# Altium project PSLink.PrjPcb (part 2 of 3)

## Sheet Channel.SchDoc: CDR, Fanout, D-FF
size 420 x 297 mm; CheckedBy: E.Orzes F.Martina S.Baron; CompanyName: CERN; DrawnBy: E.Orzes; Organization: CERN; Address1: European Organization for Nuclear Research; Address2: CH-1211 Genève 23 - Switzerland; Revision: 1.0; SheetNumber: 5; SheetTotal: 6; Projet: Phase Stable Link; DivGrp: EP-ESE; Designer: E.Orzes; ModifiedDate: -
Used 4 times, as channels U_Channel_3, U_Channel_2, U_Channel_1, U_Channel_0. Parts and nets are listed once, with the designators drawn on the sheet.
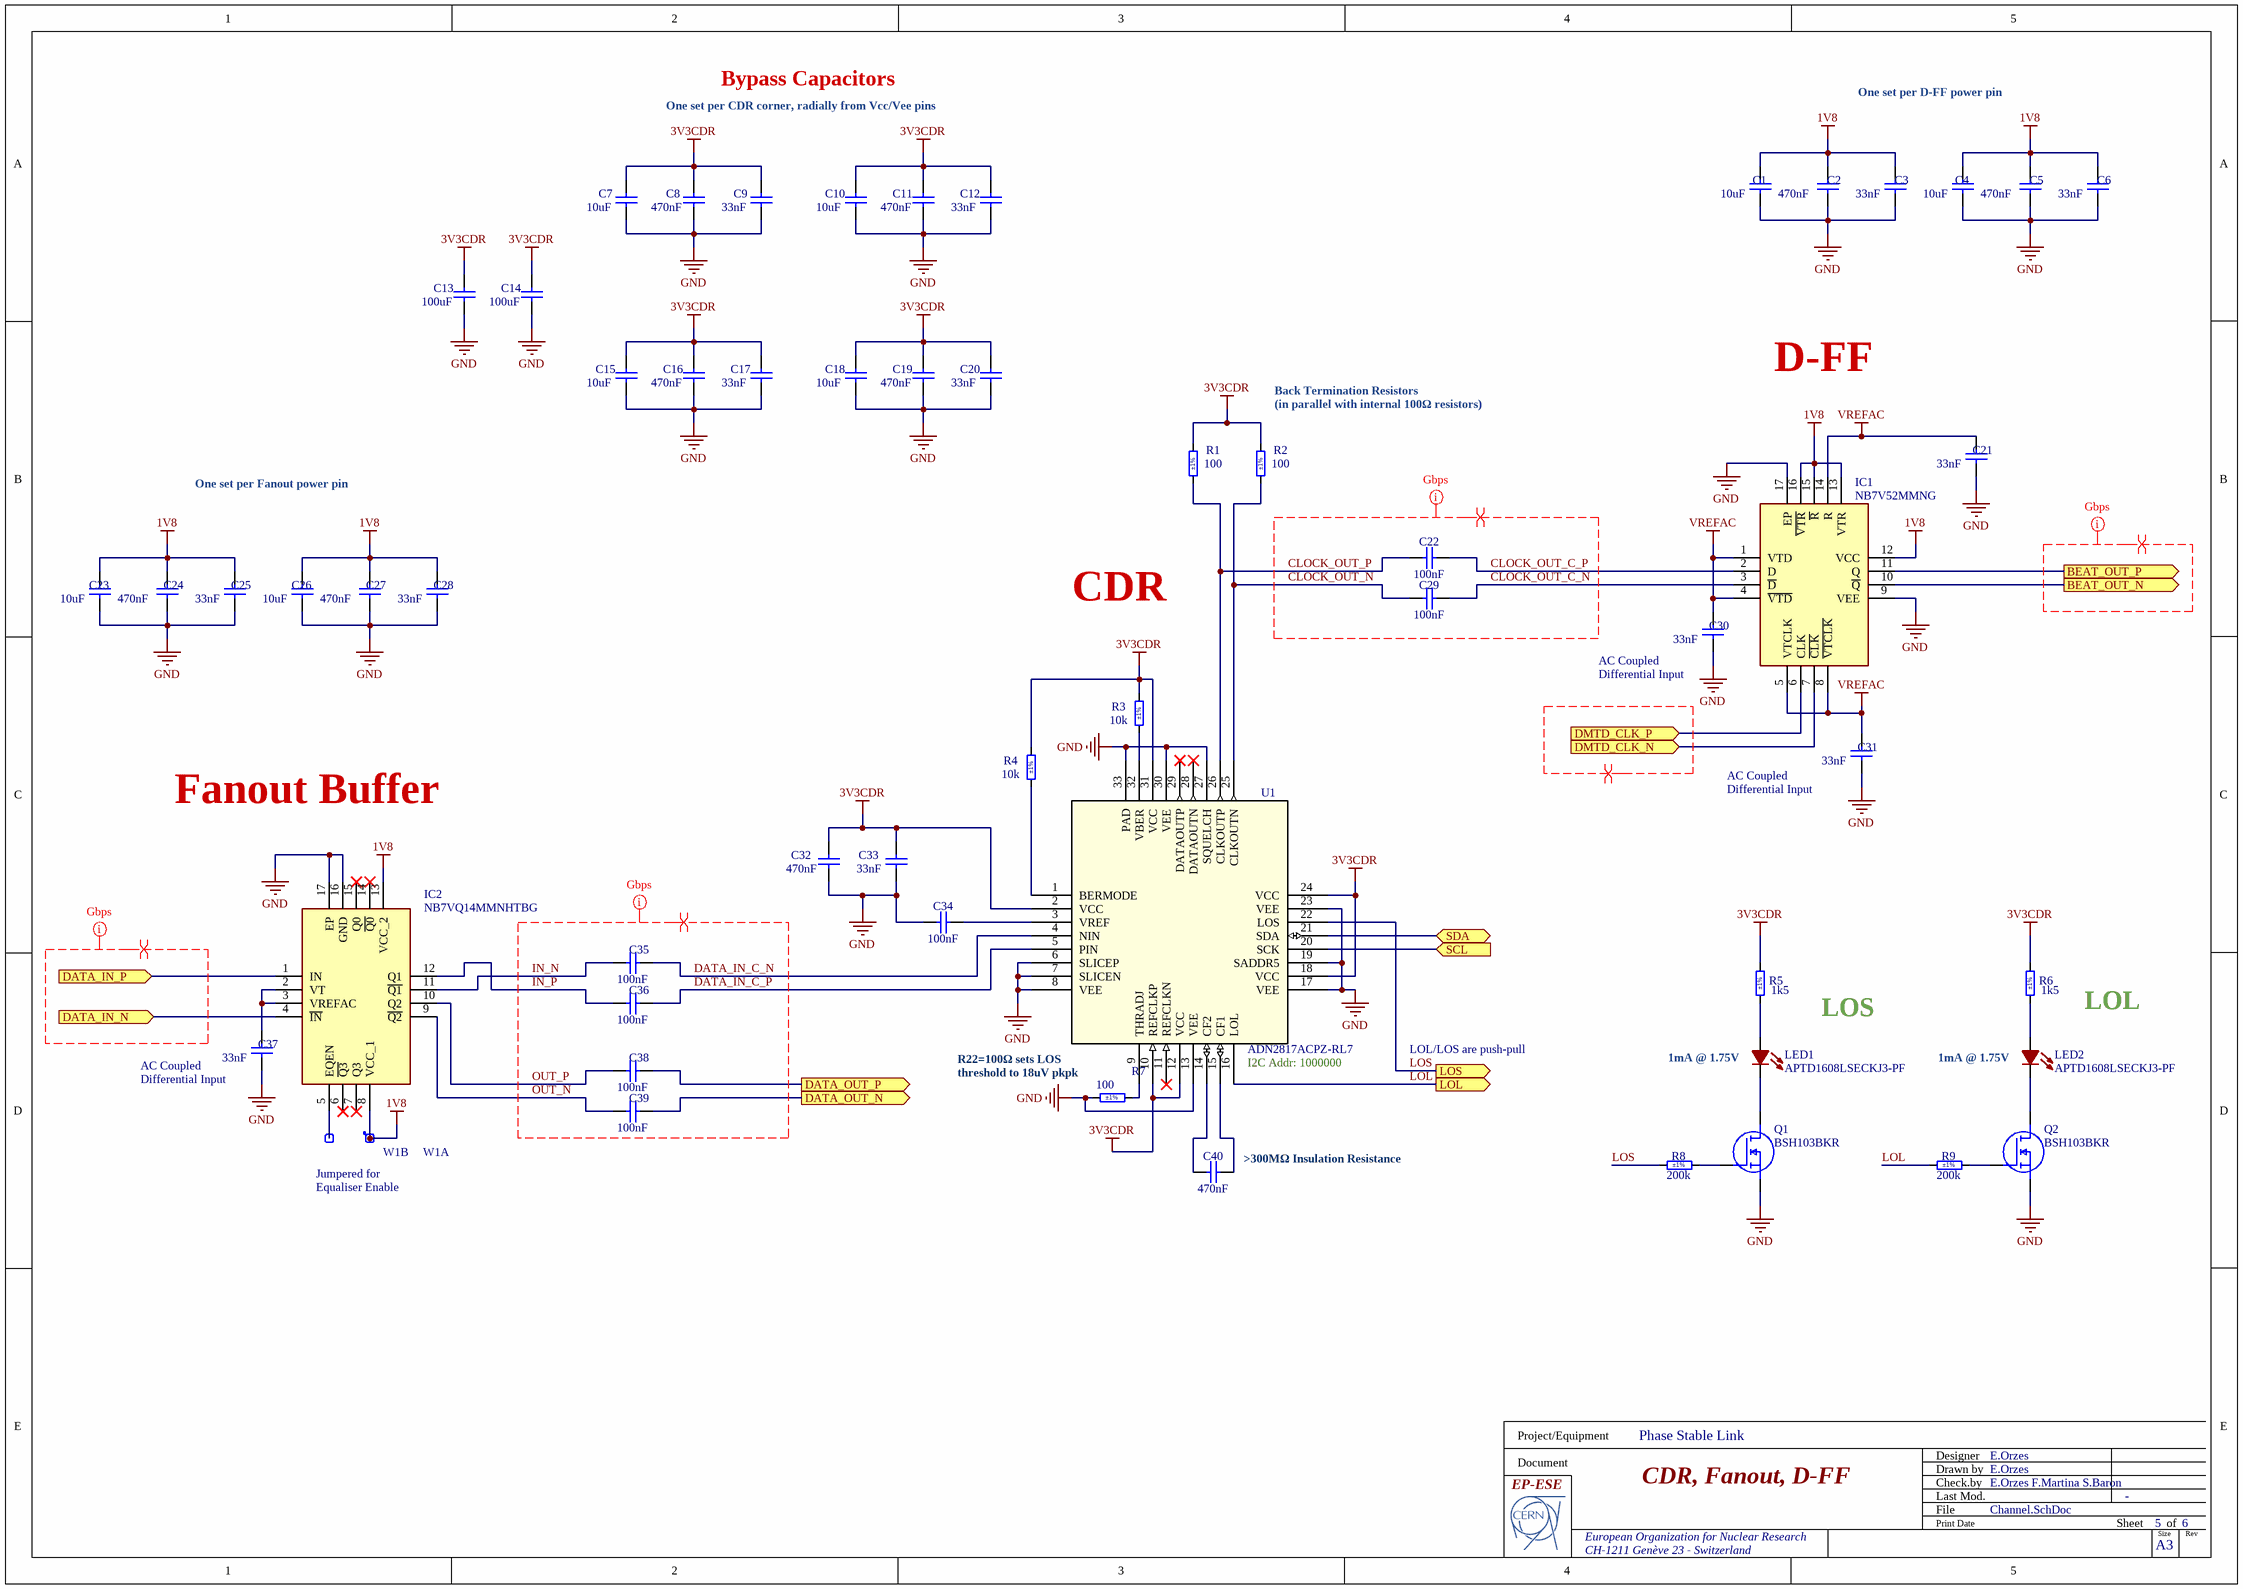
[diagram p3: Channel.SchDoc]

### Parts
C1  10uF  [CAPC1608X87N]
C2  470nF  [CAPC0510X04N]
C3  33nF  [LLL03TR61E333KE01]
C4  10uF  [CAPC1608X87N]
C5  470nF  [CAPC0510X04N]
C6  33nF  [LLL03TR61E333KE01]
C7  10uF  [CAPC1608X87N]
C8  470nF  [CAPC0510X04N]
C9  33nF  [LLL03TR61E333KE01]
C10  10uF  [CAPC1608X87N]
C11  470nF  [CAPC0510X04N]
C12  33nF  [LLL03TR61E333KE01]
C13  100uF  [CAPC3225X270N]
C14  100uF  [CAPC3225X270N]
C15  10uF  [CAPC1608X87N]
C16  470nF  [CAPC0510X04N]
C17  33nF  [LLL03TR61E333KE01]
C18  10uF  [CAPC1608X87N]
C19  470nF  [CAPC0510X04N]
C20  33nF  [LLL03TR61E333KE01]
C21  33nF  [LLL03TR61E333KE01]
C22  100nF  [CAPC0603X33N]
C23  10uF  [CAPC1608X87N]
C24  470nF  [CAPC0510X04N]
C25  33nF  [LLL03TR61E333KE01]
C26  10uF  [CAPC1608X87N]
C27  470nF  [CAPC0510X04N]
C28  33nF  [LLL03TR61E333KE01]
C29  100nF  [CAPC0603X33N]
C30  33nF  [LLL03TR61E333KE01]
C31  33nF  [LLL03TR61E333KE01]
C32  470nF  [CAPC0510X04N]
C33  33nF  [LLL03TR61E333KE01]
C34  100nF  [CAPC0603X33N]
C35  100nF  [CAPC0603X33N]
C36  100nF  [CAPC0603X33N]
C37  33nF  [LLL03TR61E333KE01]
C38  100nF  [CAPC0603X33N]
C39  100nF  [CAPC0603X33N]
C40  470nF  [CAPC2013X140N]
IC1  NB7V52MMNG  [QFN50P300X300X100-17N]
IC2  NB7VQ14MMNHTBG  [QFN50P300X300X100-17N]
LED1  APTD1608LSECKJ3-PF  [LED_APTD1608LSECKJ3-PF_KNB]
LED2  APTD1608LSECKJ3-PF  [LED_APTD1608LSECKJ3-PF_KNB]
Q1  BSH103BKR  [SOT95P230X110-3N]
Q2  BSH103BKR  [SOT95P230X110-3N]
R1  100  Tolerance: ±1%  [RESC0603X28N]
R2  100  Tolerance: ±1%  [RESC0603X28N]
R3  10k  Tolerance: ±1%  [RESC1005X40N]
R4  10k  Tolerance: ±1%  [RESC1005X40N]
R5  1k5  Tolerance: ±1%  [RESC1005X40N]
R6  1k5  Tolerance: ±1%  [RESC1005X40N]
R7  100  Tolerance: ±1%  [RESC0603X28N]
R8  200k  Tolerance: ±1%  [RESC1005X40N]
R9  200k  Tolerance: ±1%  [RESC1005X40N]
U1  ADN2817ACPZ-RL7  [CP_32_11_ADI]
W1  Header 2  [SAMTEC_HTSW-102-23-L-S]  (value not drawn)  (parts A,B of 2)

### Ports
BEAT_OUT_N (out), BEAT_OUT_P (out), DATA_IN_N (in), DATA_IN_P (in), DATA_OUT_N (out), DATA_OUT_P (out), DMTD_CLK_N (in), DMTD_CLK_P (in), LOL (out), LOS (out), SCL (in), SDA (bidir)

### Nets
1V8: C1.2 C2.2 C3.2 C4.2 C5.2 C6.2 C23.2 C24.2 C25.2 C26.2 C27.2 C28.2 IC1.12(VCC) IC1.13(VTR) IC1.15(~{R}) IC1.16(~{VTR}) IC2.8(VCC_1) IC2.13(VCC_2) W1.1
3V3CDR: C7.2 C8.2 C9.2 C10.2 C11.2 C12.2 C13.2 C14.2 C15.2 C16.2 C17.2 C18.2 C19.2 C20.2 C32.2 C33.2 R1.2 R2.2 R3.2 R4.2 R5.2 R6.2 U1.2(VCC) U1.10(REFCLKP) U1.12(VCC) U1.18(VCC) U1.24(VCC) U1.31(VCC)
GND: C1.1 C2.1 C3.1 C4.1 C5.1 C6.1 C7.1 C8.1 C9.1 C10.1 C11.1 C12.1 C13.1 C14.1 C15.1 C16.1 C17.1 C18.1 C19.1 C20.1 C21.1 C23.1 C24.1 C25.1 C26.1 C27.1 C28.1 C30.1 C31.1 C32.1 C33.1 C34.1 C37.1 IC1.9(VEE) IC1.17(EP) IC2.16(GND) IC2.17(EP) Q1.2(S) Q2.2(S) R7.1 U1.6(SLICEP) U1.7(SLICEN) U1.8(VEE) U1.13(VEE) U1.17(VEE) U1.19(SADDR5) U1.23(VEE) U1.27(SQUELCH) U1.30(VEE) U1.33(PAD)
VREFAC: C21.2 C30.2 C31.2 IC1.1(VTD) IC1.4(~{VTD}) IC1.5(VTCLK) IC1.8(~{VTCLK}) IC1.14(R)
BEAT_OUT_N: IC1.10(~{Q}) ; port BEAT_OUT_N
BEAT_OUT_P: IC1.11(Q) ; port BEAT_OUT_P
CLOCK_OUT_C_N: C29.2 IC1.3(~{D})
CLOCK_OUT_C_P: C22.2 IC1.2(D)
CLOCK_OUT_N: C29.1 R2.1 U1.25(CLKOUTN)
CLOCK_OUT_P: C22.1 R1.1 U1.26(CLKOUTP)
DATA_IN_C_N: C35.2 U1.4(NIN)
DATA_IN_C_P: C36.2 U1.5(PIN)
DATA_IN_N: IC2.4(~{IN}) ; port DATA_IN_N
DATA_IN_P: IC2.1(IN) ; port DATA_IN_P
DATA_OUT_N: C39.2 ; port DATA_OUT_N
DATA_OUT_P: C38.2 ; port DATA_OUT_P
DMTD_CLK_N: IC1.7(~{CLK}) ; port DMTD_CLK_N
DMTD_CLK_P: IC1.6(CLK) ; port DMTD_CLK_P
IN_N: C35.1 IC2.11(~{Q1})
IN_P: C36.1 IC2.12(Q1)
LOL: R9.1 U1.16(LOL) ; port LOL
LOS: R8.1 U1.22(LOS) ; port LOS
OUT_N: C39.1 IC2.9(~{Q2})
OUT_P: C38.1 IC2.10(Q2)
SCL: U1.20(SCK) ; port SCL
SDA: U1.21(SDA) ; port SDA
NetC34_2: C34.2 U1.3(VREF)
NetC37_2: C37.2 IC2.2(VT) IC2.3(VREFAC)
NetC40_1: C40.1 U1.14(CF2)
NetC40_2: C40.2 U1.15(CF1)
NetIC2_5: IC2.5(EQEN) W1.2
NetLED1_1: LED1.1(C) Q1.3(D)
NetLED1_2: LED1.2(A) R5.1
NetLED2_1: LED2.1(C) Q2.3(D)
NetLED2_2: LED2.2(A) R6.1
NetQ1_1: Q1.1(G) R8.2
NetQ2_1: Q2.1(G) R9.2
NetR3_1: R3.1 U1.32(VBER)
NetR4_1: R4.1 U1.1(BERMODE)
NetR7_2: R7.2 U1.9(THRADJ)

Not connected (* = marked no-connect by the designer): IC2 6(~{Q3})* 7(Q3)* 14(~{Q0})* 15(Q0)*; U1 11(REFCLKN)* 28(DATAOUTN)* 29(DATAOUTP)*

### Channels
U_Channel_3: designators end in _U_Channel_3; ports BEAT_OUT_N=BEAT_3_N BEAT_OUT_P=BEAT_3_P DATA_IN_N=FPGA_TX0_N DATA_IN_P=FPGA_TX0_P DATA_OUT_N=SFP_TX0_N DATA_OUT_P=SFP_TX0_P DMTD_CLK_N=DMTD_CLK_3_N DMTD_CLK_P=DMTD_CLK_3_P LOL=LOL LOS=LOL_3 SCL=SCL_2 SDA=SDA_2
U_Channel_2: designators end in _U_Channel_2; ports BEAT_OUT_N=BEAT_2_N BEAT_OUT_P=BEAT_2_P DATA_IN_N=SFP_RX1_N DATA_IN_P=SFP_RX1_P DATA_OUT_N=FPGA_RX1_N DATA_OUT_P=FPGA_RX1_P DMTD_CLK_N=DMTD_CLK_2_N DMTD_CLK_P=DMTD_CLK_2_P LOL=LOL LOS=LOL_2 SCL=SCL_3 SDA=SDA_3
U_Channel_1: designators end in _U_Channel_1; ports BEAT_OUT_N=BEAT_1_N BEAT_OUT_P=BEAT_1_P DATA_IN_N=FPGA_TX1_N DATA_IN_P=FPGA_TX1_P DATA_OUT_N=SFP_TX1_N DATA_OUT_P=SFP_TX1_P DMTD_CLK_N=DMTD_CLK_1_N DMTD_CLK_P=DMTD_CLK_1_P LOL=LOL LOS=LOL_1 SCL=SCL_4 SDA=SDA_4
U_Channel_0: designators end in _U_Channel_0; ports BEAT_OUT_N=BEAT_0_N BEAT_OUT_P=BEAT_0_P DATA_IN_N=SFP_RX0_N DATA_IN_P=SFP_RX0_P DATA_OUT_N=FPGA_RX0_N DATA_OUT_P=FPGA_RX0_P DMTD_CLK_N=DMTD_CLK_0_N DMTD_CLK_P=DMTD_CLK_0_P LOL=LOL LOS=LOL_0 SCL=SCL_5 SDA=SDA_5

### Layout directives
differential pair: (no net found under the mark), CLOCK_OUT_C_N, CLOCK_OUT_C_P, CLOCK_OUT_N, CLOCK_OUT_P, DATA_IN_C_N, DATA_IN_C_P, IN_N, IN_P, OUT_N, OUT_P
mark named Gbps: (no net found under the mark), CLOCK_OUT_C_N, CLOCK_OUT_C_P, CLOCK_OUT_N, CLOCK_OUT_P, DATA_IN_C_N, DATA_IN_C_P, IN_N, IN_P, OUT_N, OUT_P

### Notes on the sheet
- Bypass Capacitors
- One set per CDR corner, radially from Vcc/Vee pins
- One set per D-FF power pin
- D-FF
- (near R2) Back Termination Resistors
  (in parallel with internal 100Ω resistors)
- One set per Fanout power pin
- CDR
- (near C30) AC Coupled
  Differential Input
- (near C31) AC Coupled
  Differential Input
- Fanout Buffer
- (near U1) R22=100Ω sets LOS threshold to 18uV pkpk
- (near U1) I2C Addr: 1000000
- LOL/LOS are push-pull
- (near LED1) 1mA @ 1.75V
- LOS
- (near LED2) 1mA @ 1.75V
- LOL
- (near C37) AC Coupled
  Differential Input
- (near W1) Jumpered for Equaliser Enable
- (near C40) >300MΩ Insulation Resistance
- Project/Equipment
- Document
- Designer
- Drawn by
- Check.by
- File
- Last Mod.
- Print Date
- Sheet
- Size
- A3
- of
- Rev

### Library data of the parts
C1 C4 C7 C10 C15 C18 C23 C26 = CC0603_10UF_6.3V_20%_X5R: GRM188D71A106KA73; Part Description: SMD Multilayer Chip Ceramic Capacitor; Manufacturer: GENERIC; Manufacturer1 Part Number: C0603C106M9PAC; Voltage: 6.3V; TC: X5R; Tolerance: ±20%; Part Number: CC0603_10UF_6.3V_20%_X5R; Component Kind: Standard; Component Type: Standard; Pin Count: 2; Value: 10uF; Status: Preferred; Manufacturer Part Number: CC0603_10uF_6.3V_20%_X5R; Case: 0603; Mounted: Yes; Socket: No; SMD: Yes; Sense: No; Manufacturer1 Example: KEMET; Manufacturer1 ComponentHeight: 0.95mm; HelpURL: \\cern.ch\dfs\Applications\Altium\Datasheets\CC0603_X5R_KEMET.pdf; Author: CERN DEM JLC; CreateDate: 03/12/2007; LatestRevisionDate: 03/12/2007
C2 C5 C8 C11 C16 C19 C24 C27 C32 = Capacitor - non polarized: LLL153C70G474ME17; Value: 470nF
C3 C6 C9 C12 C17 C20 C21 C25 C28 C30 C31 C33 C37 = Capacitor - non polarized: LLL03TR61E333KE01; Value: 33nF
C13 C14 = CC1210_100UF_6.3V_20%_X7U: GRM32EC70J107ME15; Part Description: SMD Multilayer Chip Ceramic Capacitor; Manufacturer: GENERIC; Manufacturer1 Part Number: GRM32EE70J107ME15L; Voltage: 6.3V; TC: X7U; Tolerance: ±20%; Part Number: CC1210_100UF_6.3V_20%_X7U; Component Kind: Standard; Component Type: Standard; Pin Count: 2; Value: 100uF; Status: None; Manufacturer Part Number: CC1210_100UF_6.3V_20%_X7U; Case: 1210; Mounted: Yes; Socket: No; SMD: Yes; Sense: No; Manufacturer1 Example: MURATA; Manufacturer1 ComponentHeight: 2.7mm; HelpURL: \\cern.ch\dfs\Applications\Altium\Datasheets\CC1210_X7U_MURATA.pdf; Author: CERN DEM MR; CreateDate: 10/12/2017; LatestRevisionDate: 10/12/2017
C22 C29 C34-C36 C38 C39 = CC0201_100NF_6.3V_10%_X7R: Non-polarised capacitor; Part Description: SMD Multilayer Chip Ceramic Capacitor; Manufacturer: GENERIC; Manufacturer1 Part Number: CC0201KRX7R5BB104; Voltage: 6.3V; TC: X7R; Tolerance: ±10%; Part Number: CC0201_100NF_6.3V_10%_X7R; Component Kind: Standard; Component Type: Standard; Pin Count: 2; Value: 100nF; Status: Not Recommended; Manufacturer Part Number: CC0201_100NF_6.3V_10%_X7R; Case: 0201; Mounted: Yes; Socket: No; SMD: Yes; Sense: No; Manufacturer1 Example: YAGEO PHYCOMP; Manufacturer1 ComponentHeight: 0.33mm; HelpURL: \\cern.ch\dfs\Applications\Altium\Datasheets\CC0201_X7R_YAGEO_6.3VTO50V.pdf; Author: CERN DEM BC; CreateDate: 11/20/2020; LatestRevisionDate: 11/20/2020
C40 = CC0805_470NF_50V_10%_X7R_MURATA_GCM21BR71H474KA55L: GCM21BR71H474KA55L; Part Description: SMD Chip Monolithic Ceramic Capacitor for Automotive; Manufacturer: MURATA; Voltage: 50V; TC: X7R; Tolerance: ±10%; Part Number: CC0805_470NF_50V_10%_X7R_MURATA_GCM21BR71H474KA55L; Component Kind: Standard; Component Type: Standard; Pin Count: 2; Value: 470nF; Status: Not Recommended; Manufacturer Part Number: GCM21BR71H474KA55L; Case: 0805; Mounted: Yes; Socket: No; SMD: Yes; Sense: No; ComponentHeight: 1.4mm; HelpURL: \\cern.ch\dfs\Applications\Altium\Datasheets\CC0805_MURATA_GCM21BR71H474KA55L.pdf; Author: CERN DEM JLC; CreateDate: 5/10/2017; LatestRevisionDate: 5/10/2017
IC1 = NB7V52MMNG: Integrated Circuit; Manufacturer_Name: onsemi; Datasheet Link: https://www.onsemi.com/pdf/datasheet/nb7v52m-d.pdf; Height: 1mm; Manufacturer_Part_Number: NB7V52MMNG; Mouser Part Number: 863-NB7V52MMNG; Mouser Price/Stock: https://www.mouser.co.uk/ProductDetail/ON-Semiconductor/NB7V52MMNG?qs=N5dOQkml4H8i91m%252BmwlaUQ%3D%3D; Arrow Part Number: NB7V52MMNG; Arrow Price/Stock: https://www.arrow.com/en/products/nb7v52mmng/on-semiconductor
IC2 = NB7VQ14MMNHTBG: Integrated Circuit; Manufacturer_Name: onsemi; Datasheet Link: http://www.onsemi.com/pub/Collateral/NB7VQ14M-D.PDF; Height: 1mm; Manufacturer_Part_Number: NB7VQ14MMNHTBG; Mouser Part Number: 863-NB7VQ14MMNHTBG; Mouser Price/Stock: https://www.mouser.co.uk/ProductDetail/onsemi/NB7VQ14MMNHTBG?qs=3PKVEWFFm2%2FWq%2FFZ4xstfg%3D%3D; Arrow Part Number: NB7VQ14MMNHTBG; Arrow Price/Stock: https://www.arrow.com/en/products/nb7vq14mmnhtbg/on-semiconductor?utm_currency=USD&region=nac
LED1 LED2 = APTD1608LSECKJ3-PF: Led Red 0603 2mA 1.8V 50mcd 84mW; Mfr_Name: Kingbright
Q1 Q2 = BSH103BKR: MOSFET (N-Channel); Manufacturer_Name: Nexperia; Datasheet Link: https://ms.componentsearchengine.com/Datasheets/2/BSH103BKR.pdf; Height: 1.1mm; Manufacturer_Part_Number: BSH103BKR; Mouser Part Number: 771-BSH103BKR; Mouser Price/Stock: https://www.mouser.co.uk/ProductDetail/Nexperia/BSH103BKR?qs=GCAb4wyKXLKD%2FWt2ta8c7Q%3D%3D; Arrow Part Number: BSH103BKR; Arrow Price/Stock: https://www.arrow.com/en/products/bsh103bkr/nexperia?region=europe
R1 R2 R7 = R0201_100R_1%_0.05W_200PPM: Resistor - 1%; Part Description: Thick Film Chip Resistor; Manufacturer: GENERIC; Manufacturer1 Part Number: CRCW0201100RFNED; Power: 0.05W; TC: ±200ppm/°C; PressFit: No; Part Number: R0201_100R_1%_0.05W_200PPM; Component Kind: Standard; Component Type: Standard; Pin Count: 2; Value: 100; Status: Not Recommended; Manufacturer Part Number: R0201_100R_1%_0.05W_200PPM; Case: 0201; Mounted: Yes; Sense: No; Socket: No; SMD: Yes; Manufacturer1 Example: VISHAY; Manufacturer1 ComponentHeight: 0.27mm; HelpURL: \\cern.ch\dfs\Applications\Altium\Datasheets\R0201_VISHAY_CRCW e3.pdf; Author: CERN DEM JLC; CreateDate: 11/13/2014; LatestRevisionDate: 11/13/2014
R3 = R0402_10K_1%_0.0625W_100PPM: Resistor - 1%; Part Description: General Purpose Thick Film Chip Resistor; Manufacturer: GENERIC; Manufacturer1 Part Number: 232270671003L; TC: ±100ppm/°C; PressFit: No; Mounted: No; Part Number: R0402_10K_1%_0.0625W_100PPM; Component Kind: Standard; Component Type: Standard; Pin Count: 2; Value: 10k; Status: Not Recommended; Power: 0.0625W; Manufacturer Part Number: R0402_10K_1%_0.0625W_100PPM; Case: 0402; Sense: No; Socket: No; SMD: Yes; Manufacturer1 Example: YAGEO PHYCOMP; Manufacturer1 ComponentHeight: 0.4mm; HelpURL: \\cern.ch\dfs\Applications\Altium\Datasheets\R0402_Phycomp_RC0402.pdf; Author: CERN DEM JLC; CreateDate: 12/3/2007; LatestRevisionDate: 10/17/2012
R4 = R0402_10K_1%_0.0625W_100PPM: Resistor - 1%; Part Description: General Purpose Thick Film Chip Resistor; Manufacturer: GENERIC; Manufacturer1 Part Number: 232270671003L; TC: ±100ppm/°C; PressFit: No; Part Number: R0402_10K_1%_0.0625W_100PPM; Component Kind: Standard; Component Type: Standard; Pin Count: 2; Value: 10k; Status: Not Recommended; Power: 0.0625W; Manufacturer Part Number: R0402_10K_1%_0.0625W_100PPM; Case: 0402; Mounted: Yes; Sense: No; Socket: No; SMD: Yes; Manufacturer1 Example: YAGEO PHYCOMP; Manufacturer1 ComponentHeight: 0.4mm; HelpURL: \\cern.ch\dfs\Applications\Altium\Datasheets\R0402_Phycomp_RC0402.pdf; Author: CERN DEM JLC; CreateDate: 12/3/2007; LatestRevisionDate: 10/17/2012
R5 R6 = R0402_1K5_1%_0.0625W_100PPM: Resistor - 1%; Part Description: General Purpose Thick Film Chip Resistor; Manufacturer: GENERIC; Manufacturer1 Part Number: 232270671502L; TC: ±100ppm/°C; PressFit: No; Part Number: R0402_1K5_1%_0.0625W_100PPM; Component Kind: Standard; Component Type: Standard; Pin Count: 2; Value: 1k5; Status: Not Recommended; Power: 0.0625W; Manufacturer Part Number: R0402_1K5_1%_0.0625W_100PPM; Case: 0402; Mounted: Yes; Sense: No; Socket: No; SMD: Yes; Manufacturer1 Example: YAGEO PHYCOMP; Manufacturer1 ComponentHeight: 0.4mm; HelpURL: \\cern.ch\dfs\Applications\Altium\Datasheets\R0402_Phycomp_RC0402.pdf; Author: CERN DEM JLC; CreateDate: 12/3/2007; LatestRevisionDate: 10/17/2012
R8 R9 = R0402_200K_1%_0.0625W_100PPM: Resistor - 1%; Part Description: General Purpose Thick Film Chip Resistor; Manufacturer: GENERIC; Manufacturer1 Part Number: 232270672004L; TC: ±100ppm/°C; PressFit: No; Part Number: R0402_200K_1%_0.0625W_100PPM; Component Kind: Standard; Component Type: Standard; Pin Count: 2; Value: 200k; Status: Not Recommended; Power: 0.0625W; Manufacturer Part Number: R0402_200K_1%_0.0625W_100PPM; Case: 0402; Mounted: Yes; Sense: No; Socket: No; SMD: Yes; Manufacturer1 Example: YAGEO PHYCOMP; Manufacturer1 ComponentHeight: 0.4mm; HelpURL: \\cern.ch\dfs\Applications\Altium\Datasheets\R0402_Phycomp_RC0402.pdf; Author: CERN DEM JLC; CreateDate: 12/3/2007; LatestRevisionDate: 10/17/2012
U1 = ADN2817ACPZ-RL7: No Description Available; Mfr_Name: Analog Devices Inc; RefDes: RefDes; Type: Type
W1 = SAMTEC_HTSW-102-23-L-S: 2 Mini Wire-Wrap Contact Strip Header; Part Description: 2 Contacts, Pitch 2.54mm, Single Row  Through Mount Straight Header (Post Lead 5.84mm, Tail Lead 2.92mm, Insulator 2.54mm); Manufacturer: SAMTEC; PressFit: No; Status Comment: High Temperature; Part Number: SAMTEC_HTSW-102-23-L-S; Component Kind: Standard; Component Type: Standard; Pin Count: 2; Family: Header 2; Mounted: Yes; Socket: No; SMD: No; Sense: No; Status: Preferred; Manufacturer Part Number: HTSW-102-23-L-S; ComponentHeight: 8.38mm; HelpURL: \\cern.ch\dfs\Applications\Altium\Datasheets\SAMTEC_HTSW-102-23-L-S.pdf; Author: CERN DEM JLC; CreateDate: 2/22/2018; LatestRevisionDate: 2/22/2018

## Sheet power-sheet.SchDoc: Power Regulator
size 420 x 297 mm; CheckedBy: E.Orzes F.Martina S.Baron; CompanyName: CERN; DrawnBy: E.Orzes; Organization: CERN; Address1: European Organization for Nuclear Research; Address2: CH-1211 Genève 23 - Switzerland; Revision: 1.0; SheetNumber: 6; SheetTotal: 6; Projet: Phase Stable Link; DivGrp: EP-ESE; Designer: E.Orzes; ModifiedDate: -
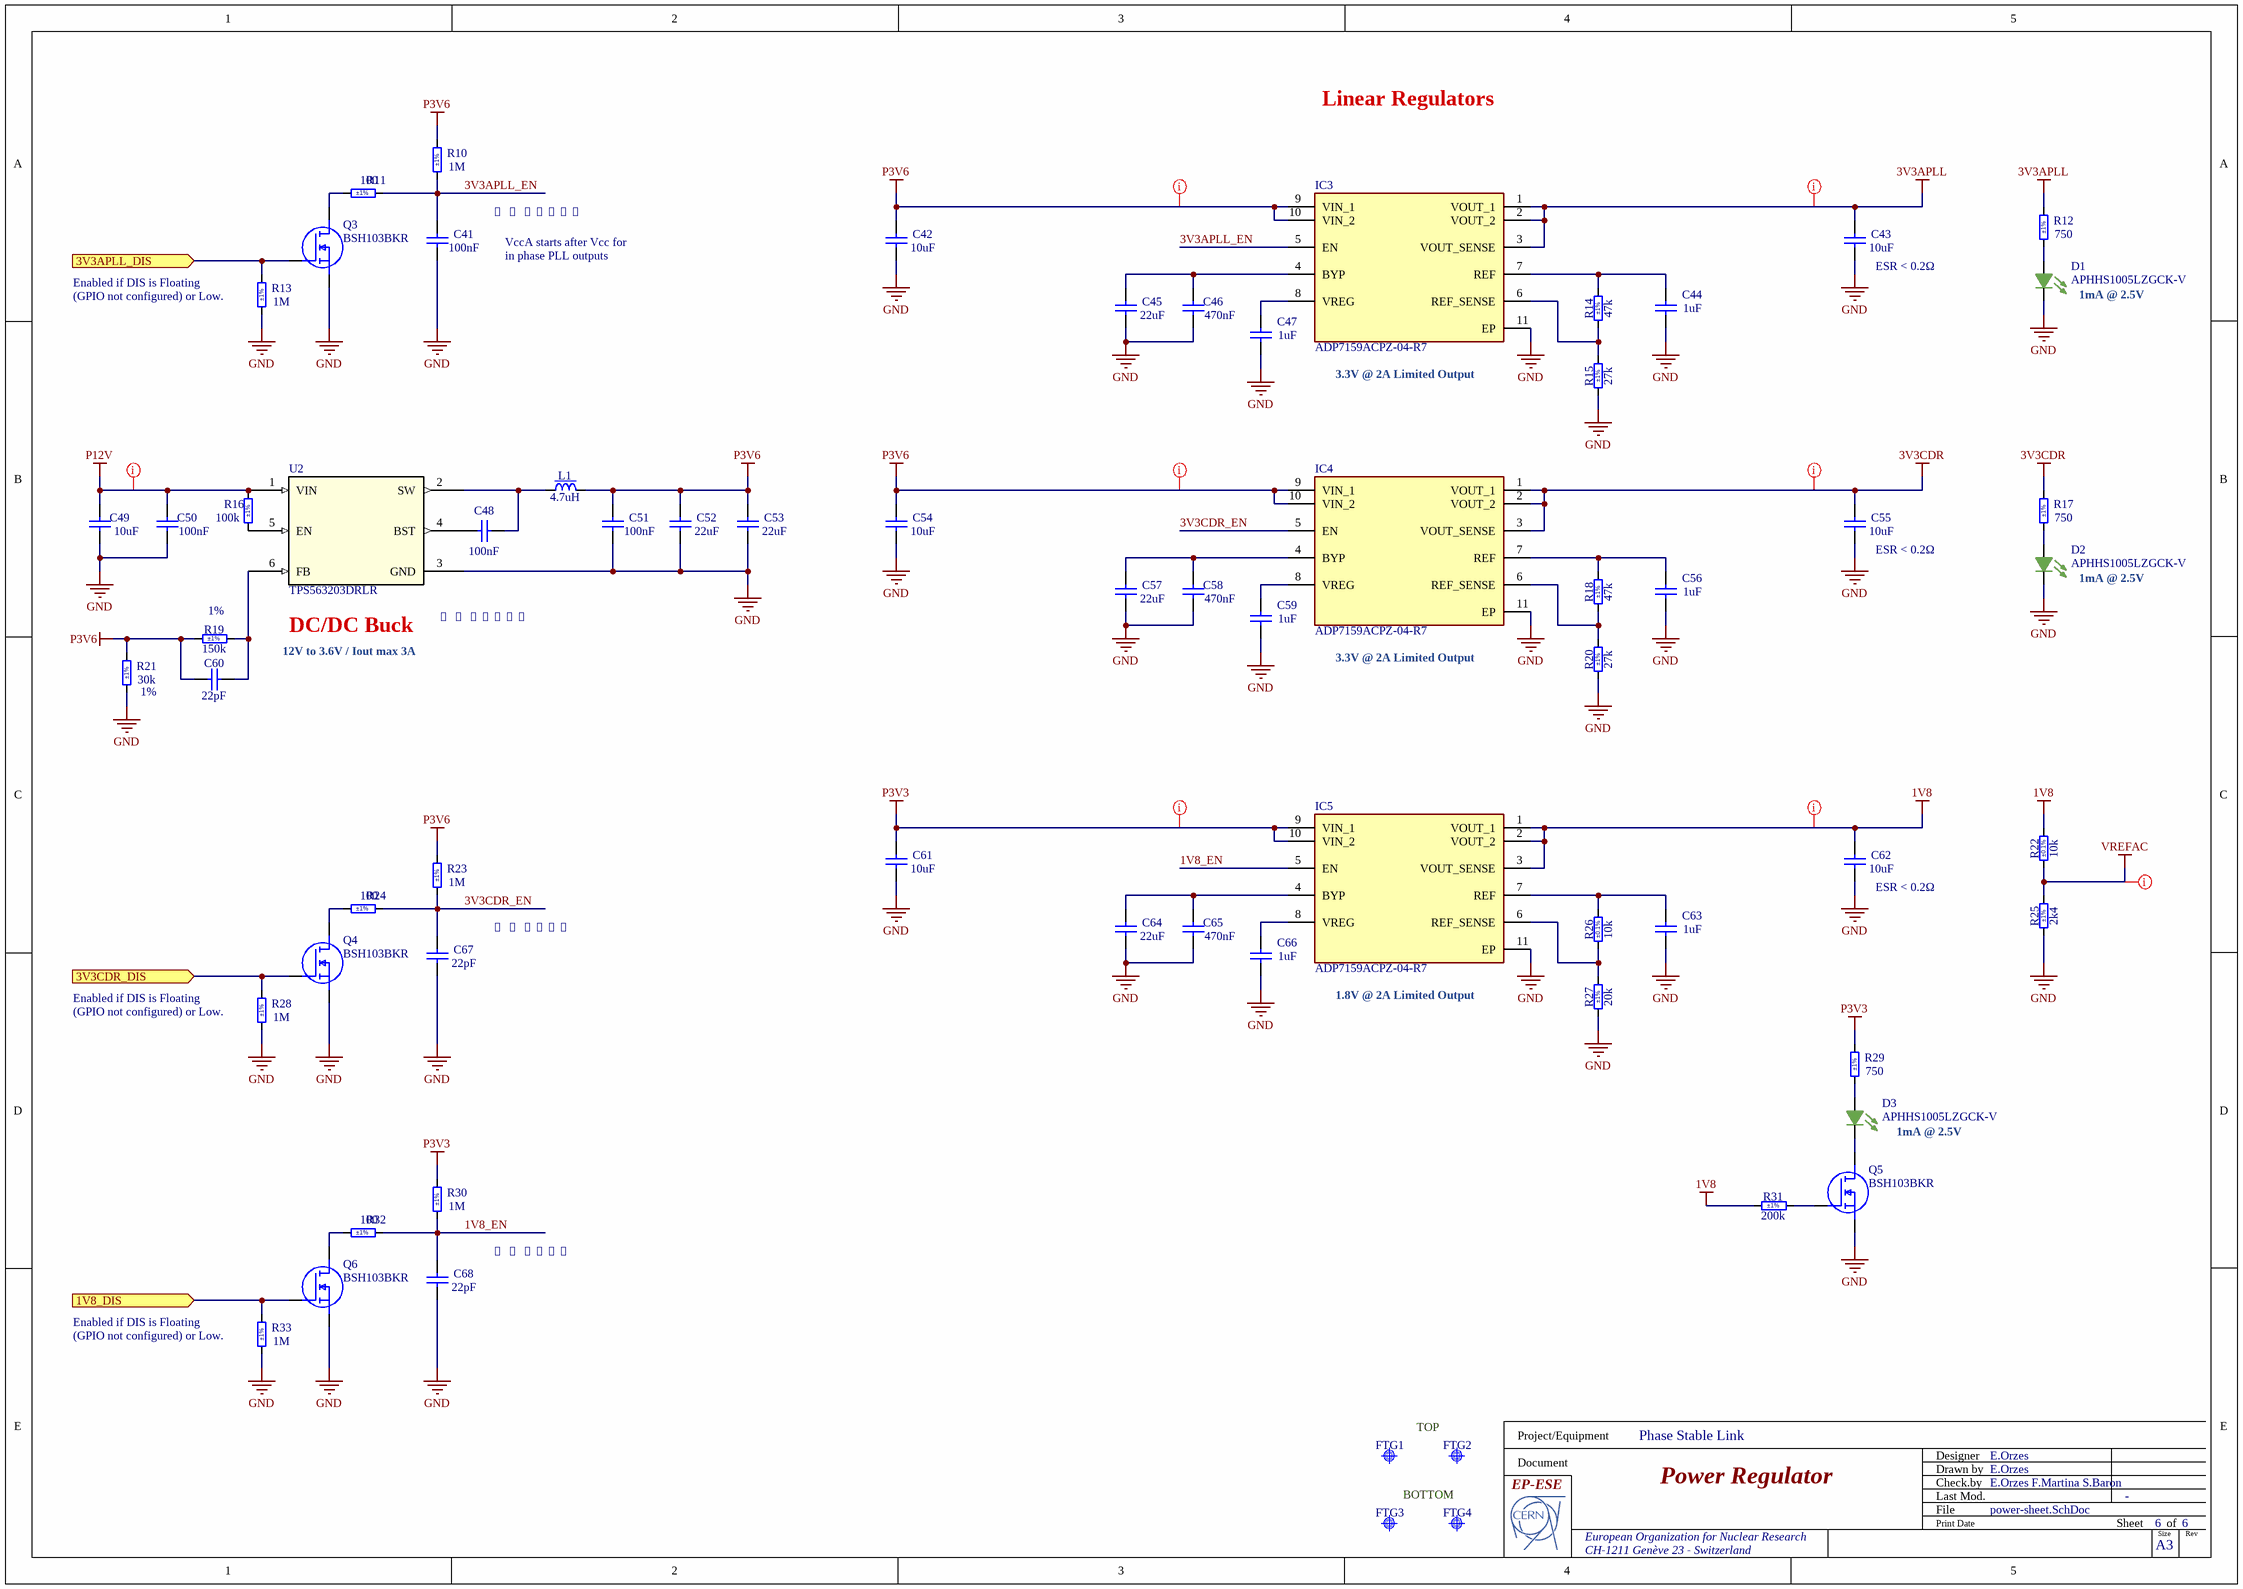
[diagram p4: power-sheet.SchDoc]

### Parts
C41  100nF  [CAPC0603X33N]
C42  10uF  [CAPC1608X87N]
C43  10uF  [CAPC1608X87N]
C44  1uF  [CAPC1005X55N]
C45  22uF  [CAPC1005X70N]
C46  470nF  [CAPC0510X04N]
C47  1uF  [CAPC1005X55N]
C48  100nF  [CAPC0603X33N]
C49  10uF  [CAPC2012X135N]
C50  100nF  [CAPC0603X33N]
C51  100nF  [CAPC0603X33N]
C52  22uF  [CAPC1005X70N]
C53  22uF  [CAPC1005X70N]
C54  10uF  [CAPC1608X87N]
C55  10uF  [CAPC1608X87N]
C56  1uF  [CAPC1005X55N]
C57  22uF  [CAPC1005X70N]
C58  470nF  [CAPC0510X04N]
C59  1uF  [CAPC1005X55N]
C60  22pF  [CAPC0603X33N]
C61  10uF  [CAPC1608X87N]
C62  10uF  [CAPC1608X87N]
C63  1uF  [CAPC1005X55N]
C64  22uF  [CAPC1005X70N]
C65  470nF  [CAPC0510X04N]
C66  1uF  [CAPC1005X55N]
C67  22pF  [CAPC0603X33N]
C68  22pF  [CAPC0603X33N]
D1  APHHS1005LZGCK-V  [LED_APHHS1005LZGCK-V]
D2  APHHS1005LZGCK-V  [LED_APHHS1005LZGCK-V]
D3  APHHS1005LZGCK-V  [LED_APHHS1005LZGCK-V]
FTG1  Use only in PCB  [FIDUCIAL_TOP_C100-200]  (value not drawn)
FTG2  Use only in PCB  [FIDUCIAL_TOP_C100-200]  (value not drawn)
FTG3  Use only in PCB  [FIDUCIAL_TOP_C100-200]  (value not drawn)
FTG4  Use only in PCB  [FIDUCIAL_TOP_C100-200]  (value not drawn)
IC3  ADP7159ACPZ-04-R7  [SON50P300X300X85-11N-D]
IC4  ADP7159ACPZ-04-R7  [SON50P300X300X85-11N-D]
IC5  ADP7159ACPZ-04-R7  [SON50P300X300X85-11N-D]
L1  4.7uH  [IND_MURATA_LQH32C]
Q3  BSH103BKR  [SOT95P230X110-3N]
Q4  BSH103BKR  [SOT95P230X110-3N]
Q5  BSH103BKR  [SOT95P230X110-3N]
Q6  BSH103BKR  [SOT95P230X110-3N]
R10  1M  Tolerance: ±1%  [RESC1005X40N]
R11  100  Tolerance: ±1%  [RESC0603X28N]
R12  750  Tolerance: ±1%  [RESC1005X40N]
R13  1M  Tolerance: ±1%  [RESC1005X40N]
R14  47k  Tolerance: ±1%  [RESC1005X40N]
R15  27k  Tolerance: ±1%  [RESC1005X40N]
R16  100k  Tolerance: ±1%  [RESC1005X40N]
R17  750  Tolerance: ±1%  [RESC1005X40N]
R18  47k  Tolerance: ±1%  [RESC1005X40N]
R19  150k  Tolerance: ±1%  [RESC1608X55N]
R20  27k  Tolerance: ±1%  [RESC1005X40N]
R21  30k  Tolerance: ±1%  [RESC1608X55N]
R22  10k  Tolerance: ±0.1%  [RESC3216X65N]
R23  1M  Tolerance: ±1%  [RESC1005X40N]
R24  100  Tolerance: ±1%  [RESC0603X28N]
R25  2k4  Tolerance: ±1%  [RESC3216X65N]
R26  10k  Tolerance: ±0.1%  [RESC1005X35N]
R27  20k  Tolerance: ±1%  [RESC1005X40N]
R28  1M  Tolerance: ±1%  [RESC1005X40N]
R29  750  Tolerance: ±1%  [RESC1005X40N]
R30  1M  Tolerance: ±1%  [RESC1005X40N]
R31  200k  Tolerance: ±1%  [RESC1005X40N]
R32  100  Tolerance: ±1%  [RESC0603X28N]
R33  1M  Tolerance: ±1%  [RESC1005X40N]
U2  TPS563203DRLR  [SOT_07SDRLR_TEX]

### Ports
1V8_DIS (in), 3V3APLL_DIS (in), 3V3CDR_DIS (in)

### Nets
1V8: C62.2 IC5.1(VOUT_1) IC5.2(VOUT_2) IC5.3(VOUT_SENSE) R22.2 R31.1
3V3APLL: C43.2 IC3.1(VOUT_1) IC3.2(VOUT_2) IC3.3(VOUT_SENSE) R12.2
3V3CDR: C55.2 IC4.1(VOUT_1) IC4.2(VOUT_2) IC4.3(VOUT_SENSE) R17.2
GND: C41.1 C42.1 C43.1 C44.1 C45.1 C46.1 C47.1 C49.1 C50.1 C51.1 C52.1 C53.1 C54.1 C55.1 C56.1 C57.1 C58.1 C59.1 C61.1 C62.1 C63.1 C64.1 C65.1 C66.1 C67.1 C68.1 D1.1(C) D2.1(C) IC3.11(EP) IC4.11(EP) IC5.11(EP) Q3.2(S) Q4.2(S) Q5.2(S) Q6.2(S) R13.1 R15.1 R20.1 R21.1 R25.1 R27.1 R28.1 R33.1 U2.3(GND)
P3V3: C61.2 IC5.9(VIN_1) IC5.10(VIN_2) R29.2 R30.2
P3V6: C42.2 C51.2 C52.2 C53.2 C54.2 C60.1 IC3.9(VIN_1) IC3.10(VIN_2) IC4.9(VIN_1) IC4.10(VIN_2) L1.2 R10.2 R19.1 R21.2 R23.2
P12V: C49.2 C50.2 R16.2 U2.1(VIN)
VREFAC: R22.1 R25.2
1V8_DIS: Q6.1(G) R33.2 ; port 1V8_DIS
1V8_EN: C68.2 IC5.5(EN) R30.1 R32.2
3V3_APLL_DIS: Q3.1(G) R13.2 ; port 3V3APLL_DIS
3V3_CDR_DIS: Q4.1(G) R28.2 ; port 3V3CDR_DIS
3V3APLL_EN: C41.2 IC3.5(EN) R10.1 R11.2
3V3CDR_EN: C67.2 IC4.5(EN) R23.1 R24.2
NetC44_2: C44.2 IC3.7(REF) R14.2
NetC45_2: C45.2 C46.2 IC3.4(BYP)
NetC47_2: C47.2 IC3.8(VREG)
NetC48_1: C48.1 L1.1 U2.2(SW)
NetC48_2: C48.2 U2.4(BST)
NetC56_2: C56.2 IC4.7(REF) R18.2
NetC57_2: C57.2 C58.2 IC4.4(BYP)
NetC59_2: C59.2 IC4.8(VREG)
NetC60_2: C60.2 R19.2 U2.6(FB)
NetC63_2: C63.2 IC5.7(REF) R26.2
NetC64_2: C64.2 C65.2 IC5.4(BYP)
NetC66_2: C66.2 IC5.8(VREG)
NetD1_2: D1.2(A) R12.1
NetD2_2: D2.2(A) R17.1
NetD3_1: D3.1(C) Q5.3(D)
NetD3_2: D3.2(A) R29.1
NetIC3_6: IC3.6(REF_SENSE) R14.1 R15.2
NetIC4_6: IC4.6(REF_SENSE) R18.1 R20.2
NetIC5_6: IC5.6(REF_SENSE) R26.1 R27.2
NetQ3_3: Q3.3(D) R11.1
NetQ4_3: Q4.3(D) R24.1
NetQ5_1: Q5.1(G) R31.2
NetQ6_3: Q6.3(D) R32.1
NetR16_1: R16.1 U2.5(EN)

### Layout directives
net class Power: 1V8, 3V3APLL, 3V3CDR, P3V3, P3V6, P12V, VREFAC

### Notes on the sheet
- Linear Regulators
- 𝜏 = 100ms
- VccA starts after Vcc for in phase PLL outputs
- (near R13) Enabled if DIS is Floating (GPIO not configured) or Low.
- (near C43) ESR < 0.2Ω
- 1mA @ 2.5V
- (near IC3) 3.3V @ 2A Limited Output
- (near C55) ESR < 0.2Ω
- (near R19) 1%
- 12V to 3.6V / Iout max 3A
- DC/DC Buck
- (near U2) 𝜏 = 1.6ms
- (near IC4) 3.3V @ 2A Limited Output
- (near R21) 1%
- 𝜏 = 22us
- (near C62) ESR < 0.2Ω
- (near IC5) 1.8V @ 2A Limited Output
- (near R28) Enabled if DIS is Floating (GPIO not configured) or Low.
- (near R33) Enabled if DIS is Floating (GPIO not configured) or Low.
- TOP
- BOTTOM
- Project/Equipment
- Document
- Designer
- Drawn by
- Check.by
- File
- Last Mod.
- Print Date
- Sheet
- Size
- A3
- of
- Rev

### Library data of the parts
C41 C48 C50 C51 = CC0201_100NF_6.3V_10%_X5R: GRM033R61C104KE14; Part Description: SMD Multilayer Chip Ceramic Capacitor; Manufacturer: GENERIC; Manufacturer1 Part Number: 02016D104KAT2A; Voltage: 6.3V; TC: X5R; Tolerance: ±10%; Part Number: CC0201_100NF_6.3V_10%_X5R; Component Kind: Standard; Component Type: Standard; Pin Count: 2; Value: 100nF; Status: Not Recommended; Manufacturer Part Number: CC0201_100NF_6.3V_10%_X5R; Case: 0201; Mounted: Yes; Socket: No; SMD: Yes; Sense: No; Manufacturer1 Example: AVX; Manufacturer1 ComponentHeight: 0.33mm; HelpURL: \\cern.ch\dfs\Applications\Altium\Datasheets\CC0201_X5R_AVX.pdf; Author: CERN DEM JLC; CreateDate: 12/3/2007; LatestRevisionDate: 12/3/2007
C42 C43 C54 C55 C61 C62 = CC0603_10UF_6.3V_20%_X5R: as C1 on sheet Channel; Part Number: CC0603_10UF_6.3V_20%_X5R; Component Kind: Standard; Component Type: Standard; Pin Count: 2; Value: 10uF; Status: Preferred; Manufacturer Part Number: CC0603_10uF_6.3V_20%_X5R; Case: 0603; Mounted: Yes; Socket: No; SMD: Yes; Sense: No; Manufacturer1 Example: KEMET; Manufacturer1 ComponentHeight: 0.95mm; HelpURL: \\cern.ch\dfs\Applications\Altium\Datasheets\CC0603_X5R_KEMET.pdf; Author: CERN DEM JLC; CreateDate: 03/12/2007; LatestRevisionDate: 03/12/2007
C44 C47 C56 C59 C63 C66 = CC0402_1UF_16V_10%_X5R: GRM153B30J105ME15; Part Description: SMD Multilayer Chip Ceramic Capacitor; Manufacturer: GENERIC; Manufacturer1 Part Number: C1005X5R1C105KT; Voltage: 16V; TC: X5R; Tolerance: ±10%; Part Number: CC0402_1UF_16V_10%_X5R; Component Kind: Standard; Component Type: Standard; Pin Count: 2; Value: 1uF; Status: Preferred; Manufacturer Part Number: CC0402_1UF_16V_10%_X5R; Case: 0402; Mounted: Yes; Socket: No; SMD: Yes; Sense: No; Manufacturer1 Example: TDK; Manufacturer1 ComponentHeight: 0.55mm; HelpURL: \\cern.ch\dfs\Applications\Altium\Datasheets\CC0402_X5R_TDK_C.pdf; Author: CERN DEM JLC; CreateDate: 10/25/2012; LatestRevisionDate: 10/25/2012
C45 C52 C53 C57 C64 = CC0402_10UF_6.3V_20%_X5R: GRM155R60J226ME11; Part Description: SMD Multilayer Chip Ceramic Capacitor; Manufacturer: GENERIC; Manufacturer1 Part Number: C1005X5R0J106M050; Value: 10uF; Voltage: 6.3V; TC: X5R; Tolerance: ±10%; Part Number: CC0402_10UF_6.3V_20%_X5R; Component Kind: Standard; Component Type: Standard; Pin Count: 2; Status: Preferred; Manufacturer Part Number: CC0402_10UF_6.3V_20%_X5R; Case: 0402; Mounted: Yes; Socket: No; SMD: Yes; Sense: No; Manufacturer1 Example: TDK; Manufacturer1 ComponentHeight: 0.70mm; HelpURL: \\cern.ch\dfs\Applications\Altium\Datasheets\CC0402_X5R_TDK_C.pdf; Author: CERN DEM JLC; CreateDate: 1/7/2015; LatestRevisionDate: 1/7/2015
C46 C58 C65 = Capacitor - non polarized: LLL153C70G474ME17; Value: 470nF
C49 = CC0805_10UF_16V_10%_X5R: GRM21BR61C106KE15; Part Description: SMD Multilayer Chip Ceramic Capacitor; Manufacturer: GENERIC; Manufacturer1 Part Number: C0805C106K4PAC; Voltage: 16V; TC: X5R; Tolerance: ±10%; Part Number: CC0805_10UF_16V_10%_X5R; Component Kind: Standard; Component Type: Standard; Pin Count: 2; Value: 10uF; Status: Preferred; Manufacturer Part Number: CC0805_10UF_16V_10%_X5R; Case: 0805; Mounted: Yes; Socket: No; SMD: Yes; Sense: No; Manufacturer1 Example: KEMET; Manufacturer1 ComponentHeight: 1.4mm; HelpURL: \\cern.ch\dfs\Applications\Altium\Datasheets\CC1206_X5R_KEMET.pdf; Author: CERN DEM JLC; CreateDate: 12/3/2007; LatestRevisionDate: 12/3/2007
C60 C67 C68 = CC0201_4.7NF_10V_10%_X5R: GJM0335C0J220GB01; Part Description: SMD Multilayer Chip Ceramic Capacitor; Manufacturer: GENERIC; Manufacturer1 Part Number: 0201ZD472KAT2A; Value: 4.7nF; Voltage: 10V; TC: X5R; Tolerance: ±10%; Part Number: CC0201_4.7NF_10V_10%_X5R; Component Kind: Standard; Component Type: Standard; Pin Count: 2; Status: Not Recommended; Manufacturer Part Number: CC0201_4.7NF_10V_10%_X5R; Case: 0201; Mounted: Yes; Socket: No; SMD: Yes; Sense: No; Manufacturer1 Example: AVX; Manufacturer1 ComponentHeight: 0.33mm; HelpURL: \\cern.ch\dfs\Applications\Altium\Datasheets\CC0201_X5R_AVX.pdf; Author: CERN DEM JLC; CreateDate: 12/3/2007; LatestRevisionDate: 12/3/2007
D1-D3 = APHHS1005LZGCK-V: Led Green 0402 2mA 2.65V 40mcd 102mW; MF: Kingbright Corporation; SnapEDA_Link: https://www.snapeda.com/parts/APHHS1005LZGCK-V/Kingbright/view-part/?ref=snap; Package: 0402 Kingbright Corporation; Value: *; MP: APHHS1005LZGCK-V; Check_prices: https://www.snapeda.com/parts/APHHS1005LZGCK-V/Kingbright/view-part/?ref=eda
FTG1-FTG4 = FIDUCIAL_TARGET_C100-200: Fiducial Target; Part Description: Round Fiducial Target, Top Layer, 1.0mm, Top Solder 2.0mm, Keepout =2.0mm; Mounted: No; Part Number: FIDUCIAL_TARGET_C100-200; Component Kind: Standard (No BOM); Component Type: Standard (No BOM); Pin Count: 1; Family: Fiducial; Socket: No; SMD: Yes; Sense: No; Status: None; ComponentHeight: 0mm; HelpURL: Undefined; Author: CERN DEM JLC; CreateDate: 09/02/2010; LatestRevisionDate: 04/04/2012; PackageDescription: Round Fiducial Target, Top Layer, 1.0mm, Top Solder 2.0mm, Keepout =2.0mm
IC3-IC5 = ADP7159ACPZ-04-R7: Integrated Circuit; Manufacturer_Name: Analog Devices; Datasheet Link: https://www.analog.com/media/en/technical-documentation/data-sheets/ADP7159.pdf; Height: 0.85mm; Manufacturer_Part_Number: ADP7159ACPZ-04-R7; Mouser Part Number: 584-ADP7159ACPZ04R7; Mouser Price/Stock: https://www.mouser.co.uk/ProductDetail/Analog-Devices/ADP7159ACPZ-04-R7?qs=JeIcUl65ClBXEAZRPtHUVQ%3D%3D; Arrow Part Number: ADP7159ACPZ-04-R7; Arrow Price/Stock: https://www.arrow.com/en/products/adp7159acpz-04-r7/analog-devices
L1 = IND_4.7UH_20%_MURATA_LQH32CN4R7M23L: Inductor With Core; Part Description: Chip Inductor (Chip Coil) for Choke Wire Wound Type; Manufacturer: MURATA; Power: 450mA; Resistance: 0.2R; Tolerance: ±20%; Part Number: IND_4.7UH_20%_MURATA_LQH32CN4R7M23L; Component Kind: Standard; Component Type: Standard; Pin Count: 2; Value: 4.7uH; Manufacturer Part Number: LQH32CN4R7M23; Mounted: Yes; Socket: No; SMD: Yes; Sense: No; ComponentHeight: 2.2mm; HelpURL: \\cern.ch\dfs\Applications\Altium\Datasheets\IND_MURATA_LQH32CN_23.pdf; Author: CERN DEM JLC; CreateDate: 4/20/2010; LatestRevisionDate: 7/4/2018
Q3-Q6 = BSH103BKR: as Q1 on sheet Channel; Datasheet Link: https://ms.componentsearchengine.com/Datasheets/2/BSH103BKR.pdf; Height: 1.1mm; Manufacturer_Part_Number: BSH103BKR; Mouser Part Number: 771-BSH103BKR; Mouser Price/Stock: https://www.mouser.co.uk/ProductDetail/Nexperia/BSH103BKR?qs=GCAb4wyKXLKD%2FWt2ta8c7Q%3D%3D; Arrow Part Number: BSH103BKR; Arrow Price/Stock: https://www.arrow.com/en/products/bsh103bkr/nexperia?region=europe
R10 R13 R23 R28 R30 R33 = R0402_1M_1%_0.0625W_100PPM: Resistor - 1%; Part Description: General Purpose Thick Film Chip Resistor; Manufacturer: GENERIC; Manufacturer1 Part Number: 232270671005L; TC: ±100ppm/°C; PressFit: No; Part Number: R0402_1M_1%_0.0625W_100PPM; Component Kind: Standard; Component Type: Standard; Pin Count: 2; Value: 1M; Status: Not Recommended; Power: 0.0625W; Manufacturer Part Number: R0402_1M_1%_0.0625W_100PPM; Case: 0402; Mounted: Yes; Sense: No; Socket: No; SMD: Yes; Manufacturer1 Example: YAGEO PHYCOMP; Manufacturer1 ComponentHeight: 0.4mm; HelpURL: \\cern.ch\dfs\Applications\Altium\Datasheets\R0402_Phycomp_RC0402.pdf; Author: CERN DEM JLC; CreateDate: 12/3/2007; LatestRevisionDate: 10/17/2012
R11 R24 R32 = R0201_100R_1%_0.05W_200PPM: as R1 on sheet Channel; Part Number: R0201_100R_1%_0.05W_200PPM; Component Kind: Standard; Component Type: Standard; Pin Count: 2; Value: 100; Status: Not Recommended; Manufacturer Part Number: R0201_100R_1%_0.05W_200PPM; Case: 0201; Mounted: Yes; Sense: No; Socket: No; SMD: Yes; Manufacturer1 Example: VISHAY; Manufacturer1 ComponentHeight: 0.27mm; HelpURL: \\cern.ch\dfs\Applications\Altium\Datasheets\R0201_VISHAY_CRCW e3.pdf; Author: CERN DEM JLC; CreateDate: 11/13/2014; LatestRevisionDate: 11/13/2014
R12 R17 R29 = R0402_750R_1%_0.0625W_100PPM: Resistor - 1%; Part Description: General Purpose Thick Film Chip Resistor; Manufacturer: GENERIC; Manufacturer1 Part Number: 232270677501L; TC: ±100ppm/°C; PressFit: No; Part Number: R0402_750R_1%_0.0625W_100PPM; Component Kind: Standard; Component Type: Standard; Pin Count: 2; Value: 750; Status: Not Recommended; Power: 0.0625W; Manufacturer Part Number: R0402_750R_1%_0.0625W_100PPM; Case: 0402; Mounted: Yes; Sense: No; Socket: No; SMD: Yes; Manufacturer1 Example: YAGEO PHYCOMP; Manufacturer1 ComponentHeight: 0.4mm; HelpURL: \\cern.ch\dfs\Applications\Altium\Datasheets\R0402_Phycomp_RC0402.pdf; Author: CERN DEM JLC; CreateDate: 12/3/2007; LatestRevisionDate: 10/17/2012
R14 R18 = R0402_47K_1%_0.0625W_100PPM: Resistor - 1%; Part Description: General Purpose Thick Film Chip Resistor; Manufacturer: GENERIC; Manufacturer1 Part Number: 232270674703L; TC: ±100ppm/°C; PressFit: No; Part Number: R0402_47K_1%_0.0625W_100PPM; Component Kind: Standard; Component Type: Standard; Pin Count: 2; Value: 47k; Status: Not Recommended; Power: 0.0625W; Manufacturer Part Number: R0402_47K_1%_0.0625W_100PPM; Case: 0402; Mounted: Yes; Sense: No; Socket: No; SMD: Yes; Manufacturer1 Example: YAGEO PHYCOMP; Manufacturer1 ComponentHeight: 0.4mm; HelpURL: \\cern.ch\dfs\Applications\Altium\Datasheets\R0402_Phycomp_RC0402.pdf; Author: CERN DEM JLC; CreateDate: 12/3/2007; LatestRevisionDate: 10/17/2012
R15 R20 = R0402_27K_1%_0.0625W_100PPM: Resistor - 1%; Part Description: General Purpose Thick Film Chip Resistor; Manufacturer: GENERIC; Manufacturer1 Part Number: 232270672703L; TC: ±100ppm/°C; PressFit: No; Part Number: R0402_27K_1%_0.0625W_100PPM; Component Kind: Standard; Component Type: Standard; Pin Count: 2; Value: 27k; Status: Not Recommended; Power: 0.0625W; Manufacturer Part Number: R0402_27K_1%_0.0625W_100PPM; Case: 0402; Mounted: Yes; Sense: No; Socket: No; SMD: Yes; Manufacturer1 Example: YAGEO PHYCOMP; Manufacturer1 ComponentHeight: 0.4mm; HelpURL: \\cern.ch\dfs\Applications\Altium\Datasheets\R0402_Phycomp_RC0402.pdf; Author: CERN DEM JLC; CreateDate: 12/3/2007; LatestRevisionDate: 10/17/2012
R16 = R0402_100K_1%_0.0625W_100PPM: Resistor - 1%; Part Description: General Purpose Thick Film Chip Resistor; Manufacturer: GENERIC; Manufacturer1 Part Number: 232270671004L; TC: ±100ppm/°C; PressFit: No; Part Number: R0402_100K_1%_0.0625W_100PPM; Component Kind: Standard; Component Type: Standard; Pin Count: 2; Value: 100k; Status: Not Recommended; Power: 0.0625W; Manufacturer Part Number: R0402_100K_1%_0.0625W_100PPM; Case: 0402; Mounted: Yes; Sense: No; Socket: No; SMD: Yes; Manufacturer1 Example: YAGEO PHYCOMP; Manufacturer1 ComponentHeight: 0.4mm; HelpURL: \\cern.ch\dfs\Applications\Altium\Datasheets\R0402_Phycomp_RC0402.pdf; Author: CERN DEM JLC; CreateDate: 12/3/2007; LatestRevisionDate: 10/17/2012
R19 = R0603_150K_1%_0.1W_100PPM: Resistor - 1%; Part Description: General Purpose Thick Film Chip Resistor; Manufacturer: GENERIC; Manufacturer1 Part Number: NRC06F1503TRF; Power: 0.1W; TC: ±100ppm/°C; PressFit: No; Part Number: R0603_150K_1%_0.1W_100PPM; Component Kind: Standard; Component Type: Standard; Pin Count: 2; Value: 150k; Status: Preferred; Manufacturer Part Number: R0603_150K_1%_0.1W_100PPM; Case: 0603; Mounted: Yes; Sense: No; Socket: No; SMD: Yes; Manufacturer1 Example: NIC COMPONENT; Manufacturer1 ComponentHeight: 0.55mm; HelpURL: \\cern.ch\dfs\Applications\Altium\Datasheets\R0603_NIC_NRC.pdf; Author: CERN DEM JLC; CreateDate: 12/3/2007; LatestRevisionDate: 3/13/2008
R21 = R0603_30K_1%_0.1W_100PPM: Resistor - 1%; Part Description: General Purpose Thick Film Chip Resistor; Manufacturer: GENERIC; Manufacturer1 Part Number: NRC06F3002TRF; Power: 0.1W; TC: ±100ppm/°C; PressFit: No; Part Number: R0603_30K_1%_0.1W_100PPM; Component Kind: Standard; Component Type: Standard; Pin Count: 2; Value: 30k; Status: Preferred; Manufacturer Part Number: R0603_30K_1%_0.1W_100PPM; Case: 0603; Mounted: Yes; Sense: No; Socket: No; SMD: Yes; Manufacturer1 Example: NIC COMPONENT; Manufacturer1 ComponentHeight: 0.55mm; HelpURL: \\cern.ch\dfs\Applications\Altium\Datasheets\R0603_NIC_NRC.pdf; Author: CERN DEM JLC; CreateDate: 12/3/2007; LatestRevisionDate: 3/13/2008
R22 = R1206_10K_0.1%_0.25W_25PPM: Resistor - 0.1%; Part Description: Thin Film Chip Resistor; Manufacturer: GENERIC; Manufacturer1 Part Number: RN73H2BTTD1002B25; Power: 0.25W; TC: ±25ppm/°C; PressFit: No; Part Number: R1206_10K_0.1%_0.25W_25PPM; Component Kind: Standard; Component Type: Standard; Pin Count: 2; Value: 10k; Status: Not Recommended; Manufacturer Part Number: R1206_10K_0.1%_0.25W_25PPM; Case: 1206; Mounted: Yes; Sense: No; Socket: No; SMD: Yes; Manufacturer1 Example: KOA; Manufacturer1 ComponentHeight: 0.70mm; HelpURL: \\cern.ch\dfs\Applications\Altium\Datasheets\R1206_KOA_RN73H.pdf; Author: CERN DEM JLC; CreateDate: 12/3/2007; LatestRevisionDate: 11/1/2011
R25 = R1206_2K4_1%_0.25W_100PPM: Resistor - 1%; Part Description: General Purpose Thick Film Chip Resistor; Manufacturer: GENERIC; Manufacturer1 Part Number: NRC12F2401TRF; Power: 0.25W; TC: ±100ppm/°C; PressFit: No; Part Number: R1206_2K4_1%_0.25W_100PPM; Component Kind: Standard; Component Type: Standard; Pin Count: 2; Value: 2k4; Status: Preferred; Manufacturer Part Number: R1206_2K4_1%_0.25W_100PPM; Case: 1206; Mounted: Yes; Sense: No; Socket: No; SMD: Yes; Manufacturer1 Example: NIC COMPONENT; Manufacturer1 ComponentHeight: 0.65mm; HelpURL: \\cern.ch\dfs\Applications\Altium\Datasheets\R1206_NIC_NRC.pdf; Author: CERN DEM JLC; CreateDate: 12/3/2007; LatestRevisionDate: 3/13/2008
R26 = R0402_10K_0.1%_0.063W_25PPM: Resistor - 0.1%; Part Description: Thin Film Precision Resistor; Manufacturer: GENERIC; Manufacturer1 Part Number: CPF0402B10KE1; Power: 0.063W; TC: ±25ppm/°C; PressFit: No; Part Number: R0402_10K_0.1%_0.063W_25PPM; Component Kind: Standard; Component Type: Standard; Pin Count: 2; Value: 10k; Status: Not Recommended; Manufacturer Part Number: R0402_10K_0.1%_0.063W_25PPM; Case: 0402; Mounted: Yes; Sense: No; Socket: No; SMD: Yes; Manufacturer1 Example: TE CONNECTIVITY; Manufacturer1 ComponentHeight: 0.35mm; HelpURL: \\cern.ch\dfs\Applications\Altium\Datasheets\R0402_TYCO_CPF.pdf; Author: CERN DEM JMW; CreateDate: 9/22/2015; LatestRevisionDate: 9/22/2015
R27 = R0402_20K_1%_0.0625W_100PPM: Resistor - 1%; Part Description: General Purpose Thick Film Chip Resistor; Manufacturer: GENERIC; Manufacturer1 Part Number: 232270672003L; TC: ±100ppm/°C; PressFit: No; Part Number: R0402_20K_1%_0.0625W_100PPM; Component Kind: Standard; Component Type: Standard; Pin Count: 2; Value: 20k; Status: Not Recommended; Power: 0.0625W; Manufacturer Part Number: R0402_20K_1%_0.0625W_100PPM; Case: 0402; Mounted: Yes; Sense: No; Socket: No; SMD: Yes; Manufacturer1 Example: YAGEO PHYCOMP; Manufacturer1 ComponentHeight: 0.4mm; HelpURL: \\cern.ch\dfs\Applications\Altium\Datasheets\R0402_Phycomp_RC0402.pdf; Author: CERN DEM JLC; CreateDate: 12/3/2007; LatestRevisionDate: 10/17/2012
R31 = R0402_200K_1%_0.0625W_100PPM: as R8 on sheet Channel; Part Number: R0402_200K_1%_0.0625W_100PPM; Component Kind: Standard; Component Type: Standard; Pin Count: 2; Value: 200k; Status: Not Recommended; Power: 0.0625W; Manufacturer Part Number: R0402_200K_1%_0.0625W_100PPM; Case: 0402; Mounted: Yes; Sense: No; Socket: No; SMD: Yes; Manufacturer1 Example: YAGEO PHYCOMP; Manufacturer1 ComponentHeight: 0.4mm; HelpURL: \\cern.ch\dfs\Applications\Altium\Datasheets\R0402_Phycomp_RC0402.pdf; Author: CERN DEM JLC; CreateDate: 12/3/2007; LatestRevisionDate: 10/17/2012
U2 = TPS563203DRLR: No Description Available; Mfr_Name: Texas Instruments; Type: Power Management; RefDes: RefDes